# EAGLE design schematic-version3 - Jigbin (EAGLE 8.6.0)
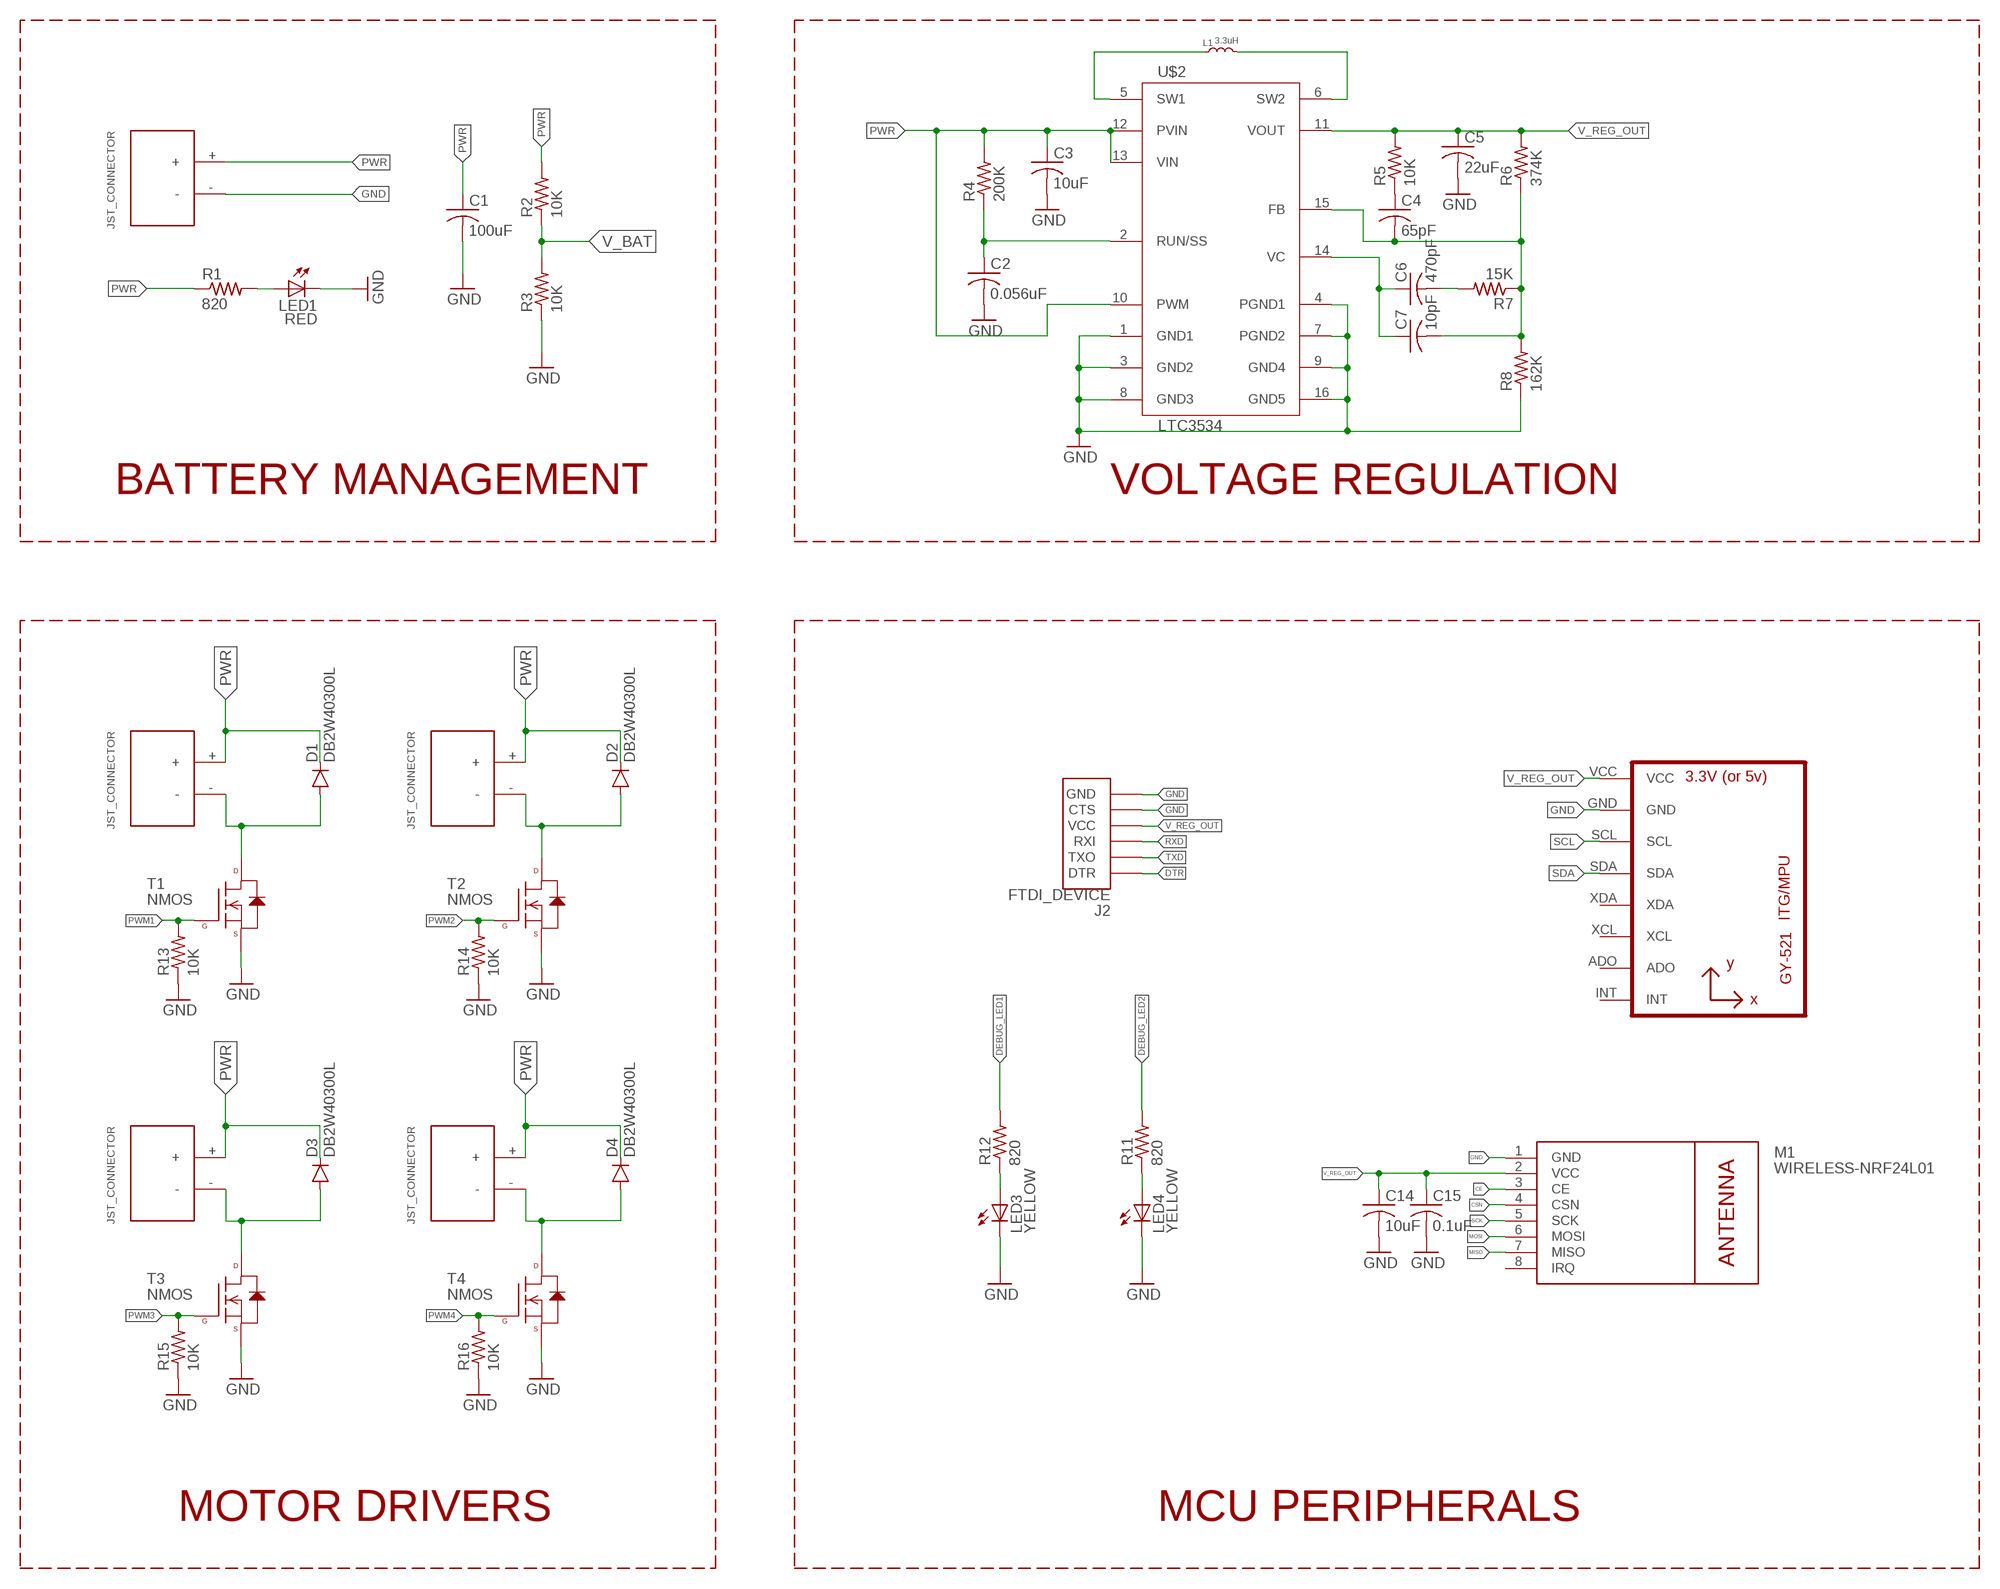
[diagram p0: schematic, sheet 1, part 1 of 2]
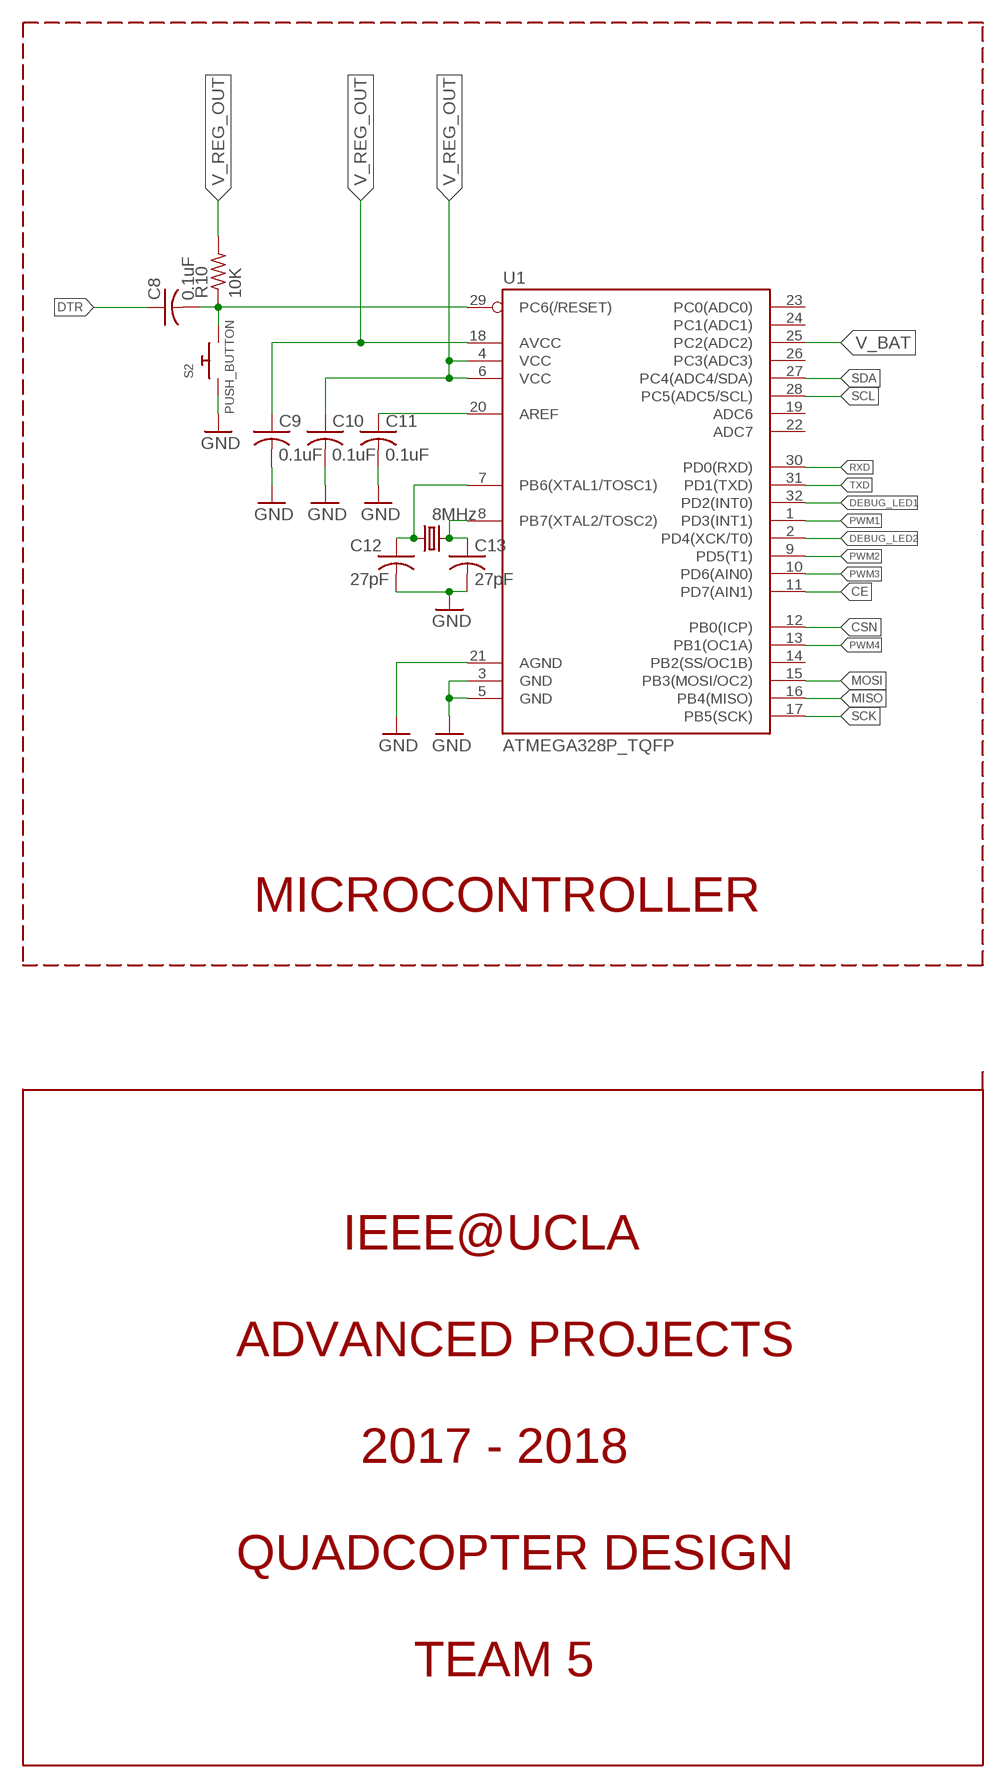
[diagram p1: schematic, sheet 1, part 2 of 2]

## Parts
C1  100uF  C-USC1210  [C1210]
C2  0.056uF  C-USC0603  [C0603]
C3  10uF  C-USC0603  [C0603]
C4  65pF  C-USC1206  [C1206]
C5  22uF  C-USC0603  [C0603]
C6  470pF  C-USC0603  [C0603]
C7  10pF  C-USC0603  [C0603]
C8  0.1uF  C-USC0603  [C0603]
C9  0.1uF  C-USC0603  [C0603]
C10  0.1uF  C-USC0603  [C0603]
C11  0.1uF  C-USC0603  [C0603]
C12  27pF  C-USC0603  [C0603]
C13  27pF  C-USC0603  [C0603]
C14  10uF  C-USC0603  [C0603]
C15  0.1uF  C-USC0603  [C0603]
D1  DB2W40300L  [MINI2-F3-B]
D2  DB2W40300L  [MINI2-F3-B]
D3  DB2W40300L  [MINI2-F3-B]
D4  DB2W40300L  [MINI2-F3-B]
J2  FTDI_DEVICE  [FTDI_DEVICE_SIDE]
L1  3.3uH  INDUCTOR.XAL4020  [XAL4020]
LED1  RED  LEDSML0603  [SML0603]
LED3  YELLOW  LEDSML0603  [SML0603]
LED4  YELLOW  LEDSML0603  [SML0603]
M1  WIRELESS-NRF24L01  [WIRELESS-NRF24L01]
Q1  8MHz  CSM-7X-DU  [CSM-7X-DU]
R1  820  R-US_R0603  [R0603]
R2  10K  R-US_R0603  [R0603]
R3  10K  R-US_R0603  [R0603]
R4  200K  R-US_R0603  [R0603]
R5  10K  R-US_R0603  [R0603]
R6  374K  R-US_R0603  [R0603]
R7  15K  R-US_R0603  [R0603]
R8  162K  R-US_R0603  [R0603]
R10  10K  R-US_R0603  [R0603]
R11  820  R-US_R0603  [R0603]
R12  820  R-US_R0603  [R0603]
R13  10K  R-US_R0603  [R0603]
R14  10K  R-US_R0603  [R0603]
R15  10K  R-US_R0603  [R0603]
R16  10K  R-US_R0603  [R0603]
S2  PUSH_BUTTON  SWITCH_PUSHBUTTONSOFTTOUCHSMD_SJ  [PUSHBUTTON_SMD_SJ]
T1  NMOS  N-CHANNEL-MOSFET-IRLML6244TRPBF  [SOT23-3]
T2  NMOS  N-CHANNEL-MOSFET-IRLML6244TRPBF  [SOT23-3]
T3  NMOS  N-CHANNEL-MOSFET-IRLML6244TRPBF  [SOT23-3]
T4  NMOS  N-CHANNEL-MOSFET-IRLML6244TRPBF  [SOT23-3]
U1  ATMEGA328P_TQFP  [TQFP32-08]
U2  GY-521MPU6050  [GY-521]
U$1  JST_CONNECTOR_FEMALE  [JST_CONNECTOR_FEMALE]
U$2  LTC3534  [SSOP-16GN]
U$4  JST_CONNECTOR_FEMALE  [JST_CONNECTOR_FEMALE]
U$7  JST_CONNECTOR_FEMALE  [JST_CONNECTOR_FEMALE]
U$10  JST_CONNECTOR_FEMALE  [JST_CONNECTOR_FEMALE]
U$13  JST_CONNECTOR_FEMALE  [JST_CONNECTOR_FEMALE]

## Nets
CE: M1.3(CE) U1.11(PD7(AIN1))
CSN: M1.4(CSN) U1.12(PB0(ICP))
DEBUG_LED1: R12.2 U1.32(PD2(INT0))
DEBUG_LED2: R11.2 U1.2(PD4(XCK/T0))
DTR: C8.1 J2.P$1(DTR)
GND: C1.2 C2.2 C3.2 C5.2 C9.2 C10.2 C11.2 C12.2 C13.2 C14.2 C15.2 J2.P$5(CTS) J2.P$6(GND) LED1.C LED3.C LED4.C M1.1(GND) R3.1 R8.1 R13.1 R14.1 R15.1 R16.1 S2.P$1 T1.2(S) T2.2(S) T3.2(S) T4.2(S) U1.3(GND) U1.5(GND) U1.21(AGND) U2.GND U$1.- U$2.1(GND1) U$2.3(GND2) U$2.4(PGND1) U$2.7(PGND2) U$2.8(GND3) U$2.9(GND4) U$2.16(GND5)
MISO: M1.7(MISO) U1.16(PB4(MISO))
MOSI: M1.6(MOSI) U1.15(PB3(MOSI/OC2))
N$1: C12.1 Q1.1 U1.7(PB6(XTAL1/TOSC1))
N$2: C8.2 R10.1 S2.P$2 U1.29(PC6(/RESET))
N$3: D1.POS(PPIN) T1.3(D) U$4.-
N$4: C13.1 Q1.2 U1.8(PB7(XTAL2/TOSC2))
N$5: D2.POS(PPIN) T2.3(D) U$7.-
N$6: D3.POS(PPIN) T3.3(D) U$10.-
N$7: D4.POS(PPIN) T4.3(D) U$13.-
N$8: L1.1 U$2.5(SW1)
N$9: L1.2 U$2.6(SW2)
N$10: LED1.A R1.2
N$12: LED3.A R12.1
N$13: LED4.A R11.1
N$14: C4.1 R5.1
N$16: C2.1 R4.1 U$2.2(RUN/SS)
N$18: C4.2 C7.2 R6.1 R7.1 R8.2 U$2.15(FB)
N$19: C6.1 C7.1 U$2.14(VC)
N$20: C6.2 R7.2
N$25: C11.1 U1.20(AREF)
PWM1: R13.2 T1.1(G) U1.1(PD3(INT1))
PWM2: R14.2 T2.1(G) U1.9(PD5(T1))
PWM3: R15.2 T3.1(G) U1.10(PD6(AIN0))
PWM4: R16.2 T4.1(G) U1.13(PB1(OC1A))
PWR: C1.1 C3.1 D1.NEG(GPIN) D2.NEG(GPIN) D3.NEG(GPIN) D4.NEG(GPIN) R1.1 R2.2 R4.2 U$1.+ U$2.10(PWM) U$2.12(PVIN) U$2.13(VIN) U$4.+ U$7.+ U$10.+ U$13.+
RXD: J2.P$3(RXI) U1.30(PD0(RXD))
SCK: M1.5(SCK) U1.17(PB5(SCK))
SCL: U1.28(PC5(ADC5/SCL)) U2.SCL
SDA: U1.27(PC4(ADC4/SDA)) U2.SDA
TXD: J2.P$2(TXO) U1.31(PD1(TXD))
V_BAT: R2.1 R3.2 U1.25(PC2(ADC2))
V_REG_OUT: C5.1 C9.1 C10.1 C14.1 C15.1 J2.P$4(VCC) M1.2(VCC) R5.2 R6.2 R10.2 U1.4(VCC) U1.6(VCC) U1.18(AVCC) U2.VCC U$2.11(VOUT)
Unconnected: M1.8(IRQ) U1.14(PB2(SS/OC1B)) U1.19(ADC6) U1.22(ADC7) U1.23(PC0(ADC0)) U1.24(PC1(ADC1)) U1.26(PC3(ADC3)) U2.ADO U2.INT U2.XCL U2.XDA

## Notes on the sheet
- BATTERY MANAGEMENT | VOLTAGE REGULATION
- MICROCONTROLLER
- IEEE@UCLA
- ADVANCED PROJECTS
- 2017 - 2018
- QUADCOPTER DESIGN
- TEAM 5
- MOTOR DRIVERS | MCU PERIPHERALS

## Library data of the parts
C1 C4 C8-C11 = rcl:C-US: CAPACITOR, American symbol; SPICEPREFIX: C
C2 C3 C5-C7 C12-C15 = resistor:C-US: CAPACITOR, American symbol
D1-D4 = quad:DB2W40300L
J2 = quad:FTDI_DEVICE: Connector which mates to FTDI basic or FTDI cable.
L1 = coilcraft:INDUCTOR
LED1 LED3 LED4 = led:LED: LED OSRAM: - CHIPLED LG R971, LG N971, LY N971, LG Q971, LY Q971, LO R971, LY R971 LH N974, LH R974 LS Q976, LO Q976, LY Q976 LO Q996 - Hyper CHIPLED LW Q18S LB Q993, LB Q99A, LB R99A - SideLED LS A670, LO A670, LY A670, LG A670, LP A670 LB A673, LV A673, LT A673, LW A673 LH A674 LY A675 LS A676, LA A676, LO A676, LY A676, LW A676 LS A679, LY A679, LG A679 - Hyper Micro SIDELED® LS Y876, LA Y876, LO Y876, LY Y876 LT Y87S - SmartLED LW L88C, LW L88S LB L89C, LB L89S, LG L890 LS L89K, LO L89K, LY L89K LS L896, LA L896, LO L896, LY L896 - TOPLED LS T670, LO T670, LY T670, LG T670, LP T670 LSG T670, LSP T670, LSY T670, LOP T670, LYG T670 LG T671, LOG T671, LSG T671 LB T673, LV T673, LT T673, LW T673 LH T674 LS T676, LA T676, LO T676, LY T676, LB T676, LH T676, LSB T676, LW T676 LB T67C, LV T67C, LT T67C, LS T67K, LO T67K, LY T67K, LW E67C LS E67B, LA E67B, LO E67B, LY E67B, LB E67C, LV E67C, LT E67C LW T67C LS T679, LY T679, LG T679 LS T770, LO T770, LY T770, LG T770, LP T770 LB T773, LV T773, LT T773, LW T773 LH T774 LS E675, LA E675, LY E675, LS T675 LS T776, LA T776, LO T776, LY T776, LB T776 LHGB T686 LT T68C, LB T68C - Hyper Mini TOPLED® LB M676 - Mini TOPLED Santana® LG M470 LS M47K, LO M47K, LY M47K Source: http://www.osram.convergy.de LUXEON: - LUMILED® LXK2-PW12-R00, LXK2-PW12-S00, LXK2-PW14-U00, LXK2-PW14-V00 LXK2-PM12-R00, LXK2-PM12-S00, LXK2-PM14-U00 LXK2-PE12-Q00, LXK2-PE12-R00, LXK2-PE12-S00, LXK2-PE14-T00, LXK2-PE14-U00 LXK2-PB12-K00, LXK2-PB12-L00, LXK2-PB12-M00, LXK2-PB14-N00, LXK2-PB14-P00, LXK2-PB14-Q00 LXK2-PR12-L00, LXK2-PR12-M00, LXK2-PR14-Q00, LXK2-PR14-R00 LXK2-PD12-Q00, LXK2-PD12-R00, LXK2-PD12-S00 LXK2-PH12-R00, LXK2-PH12-S00 LXK2-PL12-P00, LXK2-PL12-Q00, LXK2-PL12-R00 Source: www.luxeon.com KINGBRIGHT: KA-3528ASYC Source: www.kingbright.com
M1 = quad:WIRELESS-NRF24L01: 2.4 GHz Wireless Module based on NRF24L01 chip
Q1 = crystal:CSM-7X-DU: SMD CRYSTAL Source: www.ecsxtal.com .. Crystal 3.6864MHz CSM_7X_DU.PDF; OC_FARNELL: unknown; OC_NEWARK: unknown
R1 R11 R12 = rcl:R-US_: RESISTOR, American symbol; SPICEPREFIX: R
R2-R8 R10 R13-R16 = resistor:R-US_: RESISTOR, American symbol
S2 = adafruit:SWITCH_PUSHBUTTON: Buttons SOFTTOUCHSMD_SJ - Soft touch temporary push button (Super Junk Akihabara) Compatible with SKPMANE010 [Mouser: 688-SKPMAN] C&K_KSS = Digikey: KSS221GLFS
T1-T4 = quad:N-CHANNEL-MOSFET: N-Channel MOSFET Mode Field Effect Transistor; DATASHEET: http://www.mouser.com/ds/2/196/irlml6244pbf-936666.pdf; MOUSER: 942-IRLML6244TRPBF; URL: http://www.mouser.com/Search/ProductDetail.aspx?R=IRLML6244TRPBFvirtualkey57370000virtualkey942-IRLML6244TRPBF
U1 = quad:ATMEGA328P_TQFP; PROD_ID: IC-09069
U2 = quad:GY-521
U$1 U$4 U$7 U$10 U$13 = quad:JST_CONNECTOR_FEMALE
U$2 = LTC3534:LTC3534

## Board
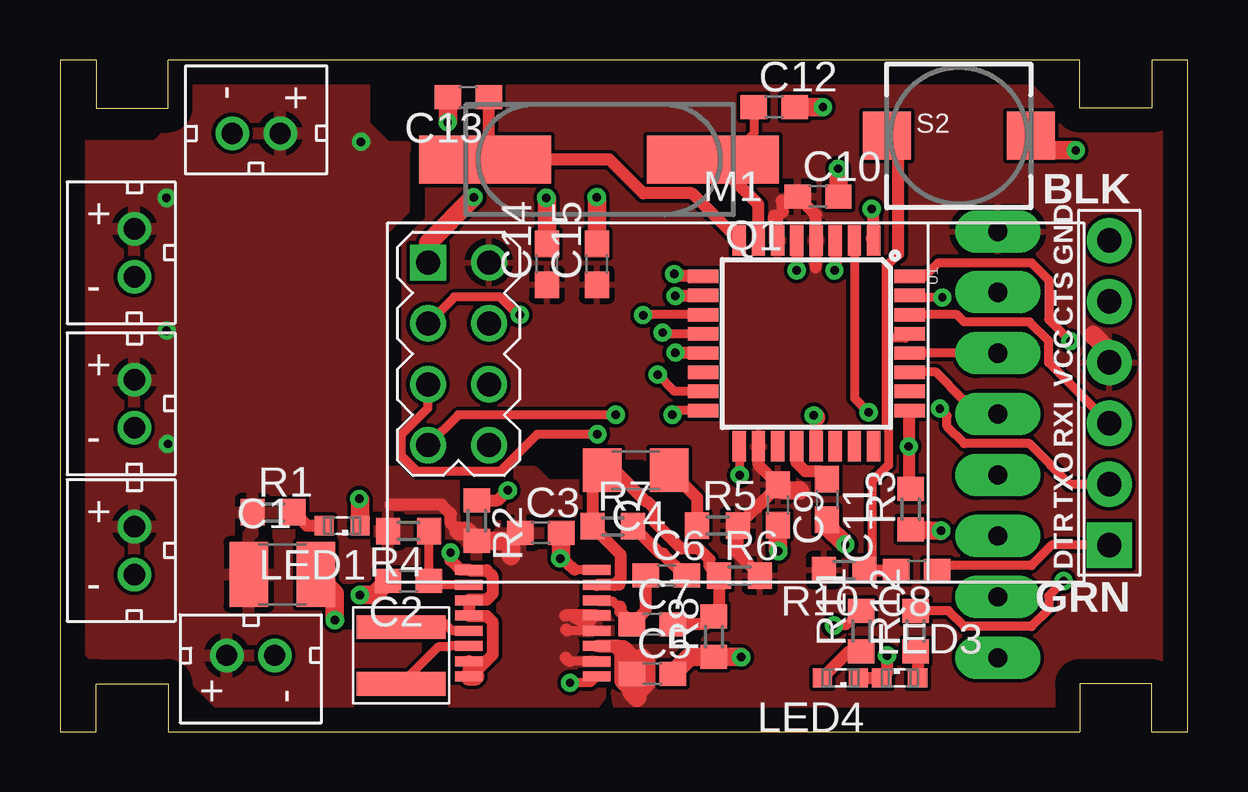
[diagram p2: board, top side]
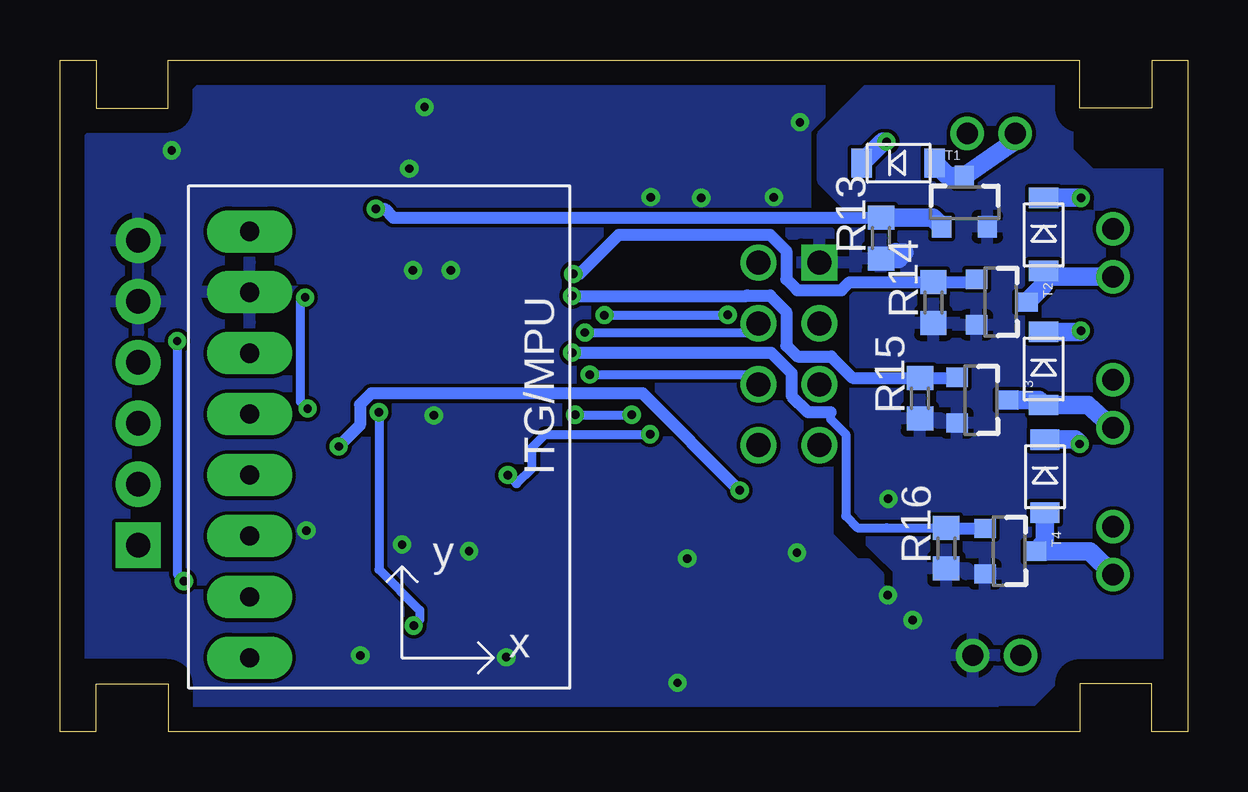
[diagram p3: board, bottom side, seen from below]

Size 47 x 28 mm. Coordinates in mm from the lower left corner, seen from the top.
Outline: 0,0 1.5,0 1.5,2 4.5,2 4.5,0 42.5,0 42.5,2 45.5,2 45.5,0 47,0 47,28 45.5,28 45.5,26 42.5,26 42.5,28 4.5,28 4.5,26 1.5,26 1.5,28 0,28 0,0
Copper layers (1*16): Top 0.035mm / dielectric 1.5mm / Bottom 0.035mm
Design rules "default": minimum track width 6mil, minimum drill 0.35mm, track to track 6mil, track to pad 6mil, pad to pad 6mil, via to via 6mil, smd to smd 6mil, copper to edge 40mil, drill to drill 6mil, minimum pad ring 10mil, minimum via ring 8mil, stop-mask expansion 4mil, vias tented up to drill 0mil, thermal gap 10mil

### Footprints (pad centres in the part's own frame; a part is rotated, then mirrored left to right if it is on the bottom)
C1210 = smd 1.6 x 2.7: 1 -1.4,0; 2 1.4,0
C0603 = smd 1.1 x 1: 1 -0.85,0; 2 0.85,0
C1206 = smd 1.6 x 1.8: 1 -1.4,0; 2 1.4,0
MINI2-F3-B = smd 1.22 x 0.85: NEG 0,1.55; POS 0,-1.5
FTDI_DEVICE_SIDE = drill 1.016 pad 1.88 square: P$1 -6.35,0 | drill 1.016 pad 1.88: P$2 -3.81,0; P$3 -1.27,0; P$4 1.27,0; P$5 3.81,0; P$6 6.35,0
XAL4020 = smd 0.98 x 3.7: 1 -1.185,0; 2 1.185,0
SML0603 = smd 0.8 x 0.8: A 0.75,0; C -0.75,0
WIRELESS-NRF24L01 = drill 1 square: 1 -12.7,6.35 | drill 1: 2 -10.16,6.35; 3 -12.7,3.81; 4 -10.16,3.81; 5 -12.7,1.27; 6 -10.16,1.27; 7 -12.7,-1.27; 8 -10.16,-1.27
CSM-7X-DU = smd 5.5 x 2: 1 -4.75,0; 2 4.75,0
R0603 = smd 1 x 1.1: 1 -0.85,0; 2 0.85,0
PUSHBUTTON_SMD_SJ = smd 2 x 2: P$1 3,0; P$2 -3,0
SOT23-3 = smd 0.8 x 0.9: 1 -0.95,-1; 2 0.95,-1; 3 0,1.1
TQFP32-08 = smd 1.27 x 0.559: 1 -4.293,2.8; 2 -4.293,2; 3 -4.293,1.2; 4 -4.293,0.4; 5 -4.293,-0.4; 6 -4.293,-1.2; 7 -4.293,-2; 8 -4.293,-2.8; 17 4.293,-2.8; 18 4.293,-2; 19 4.293,-1.2; 20 4.293,-0.4; 21 4.293,0.4; 22 4.293,1.2; 23 4.293,2; 24 4.293,2.8 | smd 0.559 x 1.27: 9 -2.8,-4.293; 10 -2,-4.293; 11 -1.2,-4.293; 12 -0.4,-4.293; 13 0.4,-4.293; 14 1.2,-4.293; 15 2,-4.293; 16 2.8,-4.293; 25 2.8,4.293; 26 2,4.293; 27 1.2,4.293; 28 0.4,4.293; 29 -0.4,4.293; 30 -1.2,4.293; 31 -2,4.293; 32 -2.8,4.293
GY-521 = drill 0.8 pad 1.778 long: ADO -8.89,-6.35; GND -8.89,6.35; INT -8.89,-8.89; SCL -8.89,3.81; SDA -8.89,1.27; VCC -8.89,8.89; XCL -8.89,-3.81; XDA -8.89,-1.27
JST_CONNECTOR_FEMALE = drill 0.889: + 0,1; - 0,-1
SSOP-16GN = smd 0.419 x 1.143: 1 -2.223,-2.667; 2 -1.587,-2.667; 3 -0.953,-2.667; 4 -0.318,-2.667; 5 0.318,-2.667; 6 0.953,-2.667; 7 1.587,-2.667; 8 2.223,-2.667; 9 2.223,2.667; 10 1.587,2.667; 11 0.953,2.667; 12 0.318,2.667; 13 -0.318,2.667; 14 -0.953,2.667; 15 -1.587,2.667; 16 -2.223,2.667

### Placement (x,y rotation side)
C1  9.27,6.55 0 top
C2  14.53,6.27 180 top
C3  20.04,8.28 0 top
C4  24,10.9 180 top
C5  24.69,2.41 0 top
C6  25.27,6.5 0 top
C7  24.69,4.47 0 top
C8  35.71,6.71 180 top
C9  29.92,9.45 270 top
C10  31.6,22.3 0 top
C11  31.98,9.68 270 top
C12  29.77,26.04 0 top
C13  17.02,26.44 180 top
C14  20.29,19.48 90 top
C15  22.38,19.48 90 top
D1  12.04,23.7 90 bottom
D2  5.99,20.7 0 bottom
D3  5.99,15.11 0 bottom
D4  5.94,10.62 0 bottom
J2  43.74,14.12 90 top
L1  14.22,3.17 270 top
LED1  11.76,8.59 180 top
LED3  35,2.24 0 top
LED4  32.54,2.24 180 top
M1  28.04,13.21 0 top
Q1  22.48,23.85 180 top
R1  8.89,9.14 0 top
R2  17.37,8.79 270 top
R3  35.46,9.27 90 top
R4  14.53,8.36 180 top
R5  27.41,8.59 0 top
R6  28.32,6.5 0 top
R7  23.04,8.56 0 top
R8  27.25,3.96 90 top
R10  32.69,6.73 180 top
R11  33.4,4.19 90 top
R12  35.66,4.19 90 top
R13  12.78,20.57 90 bottom
R14  10.59,17.88 90 bottom
R15  11.15,13.89 90 bottom
R16  10.06,7.65 90 bottom
S2  37.47,24.84 0 top
T1  9.3,22.05 0 bottom
T2  7.8,17.91 270 bottom
T3  8.61,13.82 270 bottom
T4  7.44,7.52 270 bottom
U1  31.11,16.18 270 top
U2  30.2,11.96 0 bottom
U$1  7.95,3.17 90 top
U$2  19.71,4.52 270 top
U$4  8.18,24.94 270 top
U$7  3.1,19.96 0 top
U$10  3.1,13.67 0 top
U$13  3.1,7.54 0 top

### Tracks (layer width: path | path; a pad name or v marks a point on that pad's centre or on a via)
CE  (via drill 0.35)
  Top 0.381: M1.3 16.44,18.11 18.34,18.11 19.07,17.38 v19.17,17.38 | U1.11 24.33,17.38 v24.31,17.36
  Bottom 0.381: v24.31,17.36 19.18,17.36 v19.17,17.38
CSN  (via drill 0.35)
  Top 0.381: U1.12 25.18,16.58 v25.12,16.64
  Bottom 0.381: v25.12,16.64 18.26,16.64 M1.4
DEBUG_LED1  (via drill 0.35)
  Top 0.381: U1.32 36.05,18.98 36.62,19.55 40.49,19.55 41.21,18.82 41.21,17.18 v42.11,16.28 | v41.83,6.27 41.21,5.65 41.21,5.1 40.49,4.38 37.69,4.38 37.03,5.04 R12.2
  Bottom 0.381: v42.11,16.28 42.11,6.55 v41.83,6.27
DEBUG_LED2  (via drill 0.35)
  Top 0.381: U1.2 33.12,13.9 v33.71,13.31 | v32.26,4.42 32.78,4.42 R11.2
  Bottom 0.381: v33.71,13.31 33.71,6.76 32,5.05 32,4.67 v32.26,4.42
DTR
  Top 0.381: J2.P$1 41.34,7.77 40.49,6.92 36.78,6.92 C8.1
GND  (via drill 0.35)
  Top 0.381: U$2.9 22.11,2.03 v21.26,2.03 | U$2.16 21.45,6.74
  Top 0.508: 21.45,6.74 20.89,7.25 | U1.5 v30.71,19.23 | U1.3 32.31,19.26 v32.28,19.23 | U$2.8 U$2.7 | 17.31,2.3 17.31,2.48 18.02,3.19 18.02,4.58 17.78,4.82 17.06,4.82 U$2.4 U$2.3 17.06,5.49 17.78,5.49 18.02,5.73 18.02,6.49 17.78,6.72 17.06,6.72 U$2.1 16.69,6.74 16.28,7.15 v16.28,7.46 | U1.21 31.52,13.09 | LED4.C LED3.C 34.48,2.47 v34.48,3.17
  Top 0.762: C1.2 11.46,5.77 v11.46,4.65 | C2.2 13.1,5.69 v12.5,5.69 | C3.2 20.89,7.25 v20.85,7.21 | C5.2 26.24,3.11 R8.1 28.38,3.11 v28.4,3.1 | 31.52,13.09 v31.42,13.18 | S2.P$1 40.8,24.23 v42.34,24.23 | C12.2 v31.8,26.04 | C10.2 32.45,23.46 v32.44,23.47 | C14.2 20.3,22.23 v20.27,22.25 | C15.2 v22.38,22.28 | C13.2 16.17,25.44 v16.15,25.4 | R3.1 36.72,8.37 v36.73,8.38 | LED1.C 12.51,9.66 v12.47,9.7 | 17.31,2.3 U$2.8 | M1.1 15.34,20.37 v17.25,22.28 | C11.2 31.98,8.56 v32.74,7.8 | C9.2 29.92,7.62 v29.95,7.52
  Bottom 0.762: 12.05,19.72 11.81,19.96 12.14,19.96 12.17,19.99
  Bottom 0.813: R13.1 12.05,19.72
  pour Bottom: 11.48,4.57 12.04,5.13 12.04,6.73 12.9,7.59 13.84,8.53 13.84,9.75 13.84,21.11 14.12,21.39 14.12,21.89 15.04,22.81 15.19,22.96 15.19,24.89 13,27.08 5.46,27.08 5,26.62 5,24.21 4.04,23.24 0.66,23.24 0.66,3.15 1.12,2.69 1.19,2.62 5.16,2.62 6.48,1.3 11.48,1.3 11.56,1.3 11.28,2.03
  pour Bottom: 15.34,27.05 15.34,25.68 15.8,25.22 15.95,25.07 15.95,23.67 15.95,21.82 14.81,20.68 14.3,20.17 14.3,19.99 14.3,18.97 14.55,18.72 14.68,18.59 14.68,12.52 15.01,12.19 15.01,8.15 13.84,6.99 13.36,6.99 12.9,6.53 12.9,6.07 12.06,5.23 11.18,4.34 9.65,4.34 8.51,4.34 7.98,3.81 8.13,3.66 8.13,1.22 8.13,0.91 8.64,0.41 41.38,0.41 41.78,0.81 42.06,1.09 42.06,2.9 42.44,3.28 46,3.28 46,24.51 45.19,25.32 42.6,25.32 40.89,27.03 36.14,27.03 35.46,27.71 15.95,27.71 15.37,27.13
MISO  (via drill 0.35)
  Top 0.381: M1.7 16.61,13.21 v23.16,13.21 | U1.16 25.7,13.38 v25.53,13.21
  Bottom 0.381: v25.53,13.21 v23.16,13.21
MOSI  (via drill 0.35)
  Top 0.381: U1.15 25.62,14.18 v24.92,14.88
  Bottom 0.381: v24.92,14.88 18.28,14.88 M1.6
N$1
  Top 0.381: Q1.1 27.39,23.69 27.53,23.55 28.92,24.93 C12.1
  Top 0.508: U1.7 29.11,21.03 29.11,21.97 27.39,23.69
N$2
  Top 0.381: R10.1 33.84,6.53 33.84,10.42 34.54,11.11 34.54,12.66 34.43,12.77 34.43,16.2 | U1.29 35.23,16.4 34.63,16.4 34.43,16.2 | 34.43,16.2 34.43,19.4 34.57,19.54 34.94,19.91
  Top 0.508: C8.2 33.56,6.71 R10.1 | 34.94,19.91 34.94,24.36 S2.P$2
N$3
  Bottom 0.762: U$4.- 7.18,24.63 T1.3 9.99,23.15 D1.POS
N$4
  Top 0.381: Q1.2 17.93,23.85
  Top 0.508: C13.1 17.87,23.91 17.93,23.85 | U1.8 26.34,22.44 24.31,22.44 22.9,23.85 Q1.2
N$5
  Bottom 0.762: T2.3 5.99,18.61 D2.POS 5.76,18.96 U$7.-
N$6
  Bottom 0.762: T3.3 6.2,13.82 D3.POS 4.15,13.61 U$10.-
N$7
  Bottom 0.762: D4.POS 5.94,7.92 T4.3 4.07,7.52 U$13.-
N$8
  Top 0.381: U$2.5 16.34,4.2 15.98,4.57 14.44,4.57 L1.1
N$9
  Top 0.381: U$2.6 16.26,3.57 16.22,3.53 15.76,3.53 L1.2
N$10
  Top 0.508: R1.2 10.3,8.59 LED1.A
N$12
  Top 0.508: R12.1 35.75,3.25 LED3.A
N$13
  Top 0.508: LED4.A 32.89,3.34 R11.1
N$14
  Top 0.508: C4.1 26.56,9.74 R5.1
N$16
  Top 0.381: R4.1 C2.1 15.54,6.11 U$2.2
N$18
  Top 0.508: 23.32,6.33 23.36,6.37 23.36,7.39 R7.1 22.19,10.48 C4.2 23.13,10.9 24.43,9.59 24.48,9.59 24.79,9.28 24.79,8.72 25.89,7.63 26.62,7.63 27.08,7.17 27.08,6.89 R6.1 27.47,5.03 R8.2 26.91,4.47 C7.2 | 23.32,6.33 23.32,6.13 | 23.32,6.33 23.1,6.11 U$2.15
N$19
  Top 0.381: 23.29,5.02 C7.1 | 23.36,5.22 23.27,5.22 23.05,5.44 22.42,5.44 U$2.14
  Top 0.508: C6.1 24.42,5.05 C7.1 23.84,4.51 23.36,5 23.36,5.22
N$20
  Top 0.508: R7.2 25.04,7.41 25.14,7.41 26.05,6.5 C6.2
N$25
  Top 0.508: C11.1 31.66,10.85 31.07,10.85 30.71,11.2 U1.20
PWM1  (via drill 0.35)
  Top 0.508: 33.83,20.55 U1.1 33.91,21.71 v33.83,21.79
  Bottom 0.508: v33.83,21.79 33.48,21.79 33.11,21.42 R13.2
  Bottom 0.762: R13.2 10.62,21.42 T1.1
PWM2  (via drill 0.35)
  Top 0.508: U1.9 25.7,18.98 v25.6,19.07
  Bottom 0.508: v25.6,19.07 25.34,19.07 23.7,20.72 17.4,20.72 16.72,20.04 16.72,18.86 16.26,18.4 14.42,18.4 14.09,18.73 R14.2 8.92,18.73 T2.1
PWM3  (via drill 0.35)
  Top 0.508: U1.10 26.8,18.16 v25.65,18.16
  Bottom 0.508: v25.65,18.16 18.38,18.16 18.36,18.18 17.4,18.18 16.72,17.5 16.72,16.09 16.27,15.64 14.86,15.64 13.97,14.74 R15.2 9.63,14.74 T3.1
PWM4  (via drill 0.35)
  Top 0.508: U1.13 25.7,15.78 v25.65,15.8
  Bottom 0.381: 14.88,13.32 14.88,13.03 14.24,12.39 14.24,8.99 13.75,8.49 12.55,8.49 R16.2
  Bottom 0.508: v25.65,15.8 17.36,15.8 16.5,14.94 16.5,14 15.82,13.32 14.88,13.32 | R16.2 10.03,8.47 T4.1
PWR  (via drill 0.35)
  Top 0.381: 21.74,4.2 U$2.12 21.44,4.69 21.61,4.84 | 21.74,4.2 21.14,4.2 | U$2.13 21.74,4.2 | U$2.10 21.22,2.93
  Top 0.508: 16.61,8.36 16.29,8.68 16.29,9.07 15.91,9.45 13.77,9.45 | U$2.13 21.61,4.84 21.07,4.84 21.06,4.83 | 21.14,4.2 21.11,4.24 | 21.22,2.93 21.08,3.07
  Top 0.762: 18.85,7.94 R2.2 16.95,8.36 16.61,8.36 | 18.85,7.94 C3.1 | 18.85,7.94 18.8,7.89 18.8,7.32
  Bottom 0.762: D2.NEG v4.45,22.25 | D3.NEG 4.5,16.66 v4.45,16.71 | D4.NEG 4.67,12.17 v4.5,11.99 | D1.NEG 12.7,24.59 v12.55,24.59
  pour Top: 12.7,27.43 12.42,27.15 5.41,27.15 4.88,26.62 4.88,25.25 4.04,24.41 0.51,24.41 0.51,4.06 1.96,2.62 5.18,2.62 6.73,1.07 6.73,0.74 22.05,0.86 22.53,1.5 23.65,8.94 22.17,10.26 20.32,10.26 19.76,10.82 13.56,10.82 13.41,10.97 13.41,20.83 14.35,21.77 14.35,24.23 14.48,24.36 13.61,24.36 12.7,25.27
  pour Top: 17.6,8.51 17.35,8.26 17.35,7.29 17.81,6.83 19.46,6.83 19.91,7.29 19.91,8.18 19.91,9.5 19.89,9.53 18.85,9.53 18.54,9.22 18.39,9.22 17.6,8.43
  pour Top: 17.88,7.9 17.88,7.24 18.19,6.93 18.31,6.93 18.97,6.93 19.38,7.34 19.41,7.37 19.41,8.03 19.41,8.31 19.13,8.59 19.05,8.66 18.24,8.66 17.98,8.66 17.78,8.46 17.78,7.8 17.78,7.75
RXD
  Top 0.381: J2.P$3 41.21,15.38 41.21,16.28 40.41,17.08 37.69,17.08 37.39,17.38 U1.30
SCK  (via drill 0.35)
  Top 0.381: M1.5 15.34,13.49 14.24,12.39 14.24,11.48 14.89,10.84 18.34,10.84 19.89,12.39 v22.4,12.39 | U1.17 28.32,10.81 v28.33,10.69
  Bottom 0.381: v28.33,10.69 27.98,10.34 27.96,10.34 27.33,10.97 27.33,11.84 26.77,12.39 v22.4,12.39
SCL
  Top 0.381: U2.SCL 38.35,15.78 U1.28
SDA
  Top 0.381: U2.SDA 37.76,13.83 37.67,13.83 36.52,14.98 U1.27
TXD  (via drill 0.35)
  Top 0.381: J2.P$2 42.1,10.31 40.41,12 37.69,12 36.97,12.72 36.97,13.17 v36.68,13.46 | v36.78,18.1 35.49,18.1 U1.31
  Bottom 0.381: v36.68,13.46 36.97,13.75 36.97,17.91 v36.78,18.1
V_BAT  (via drill 0.35)
  Top 0.508: R2.1 18.25,9.64 v18.67,10.06 | U1.25 35.41,11.91 v35.38,11.89 35.38,10.15 R3.2
  Bottom 0.508: v35.38,11.89 34.49,12.78 34.49,13.63 34.03,14.09 22.7,14.09 v18.67,10.06
V_REG_OUT
  Top 0.305: U$2.11 22.5,3.45 23.07,3.45 23.25,3.27 23.25,3 23.5,2.75 23.75,2.5
  Top 0.508: R10.2 32.07,6.5 | R6.2 28.26,7.42 R5.2 29.69,10.02 C9.1 29.11,11.11 U1.18 | 23.75,3.15 23.59,3.3 | 23.33,3.56 U$2.11 | 29.77,21.51 29.77,21.31 29.8,21.28 29.8,20.59 U1.6 29.91,21.47 30.14,21.7 30.14,22.08 30.07,22.15 30.59,22.15 C10.1 31.52,21.53 U1.4 31.49,20.45 31.49,19.36
  Top 0.762: C9.1 30.16,10.06 30.84,10.06 | J2.P$4 43.74,15.85 43.06,16.52 | C5.1 23.75,2.5 23.75,3.15 | 23.59,3.3 23.46,3.44 | 23.46,3.44 23.41,3.44 | 24.26,3.07 24.43,2.9 24.43,2.01 24.05,1.63 24.05,1.4 23.84,1.61 23.84,1.78 23.65,1.96 | C5.1 23.5,2.75 | C5.1 23.66,2.41 23.48,2.23 | 23.48,2.23 23.48,2.13 23.65,1.96 | 23.46,3.44 23.46,3.39 23.48,3.36 23.48,2.23 | C5.1 23.84,2.15 23.65,1.96
  pour Top: 29.51,21.64 29.51,20.09 29.54,20.07 29.69,19.91 31.88,19.91 31.88,21.69 31.88,22.43 31.62,22.68 31.06,23.24 30.78,23.24 29.87,23.24 29.77,23.14
  pour Top: 23.39,3.63 23.39,2.79 23.27,2.67 23.14,2.16 23.11,2.01 23.04,1.6 23.06,1.27 23.16,0.94 23.75,0.33 24.49,0.3 41.91,0.3 42.34,0.74 42.34,2.29 45.87,2.29 46.51,2.92 46.51,25.15 46.23,25.43 42.01,25.43 39.65,27.79 14.53,27.79 14,27.25 14,25.78 15.65,24.13 15.72,24.13 15.29,23.7 15.29,21.39 14.3,20.4 14.3,11.61 14.88,11.4 24.33,11.4 26.77,8.59 26.97,8.38 26.97,4.04 26.52,3.58 23.47,3.58